# Altium schematic sheet DAC_MAX5841.SchDoc: MAX5841 DAC
size A4; Revision: 5; SheetNumber: 41; SheetTotal: 64; Organization: Altium Limited.; Address1: Level 3, 12a Rodborough Rd; Address2: Frenchs Forest 2086; Address3: NSW; Address4: AUSTRALIA
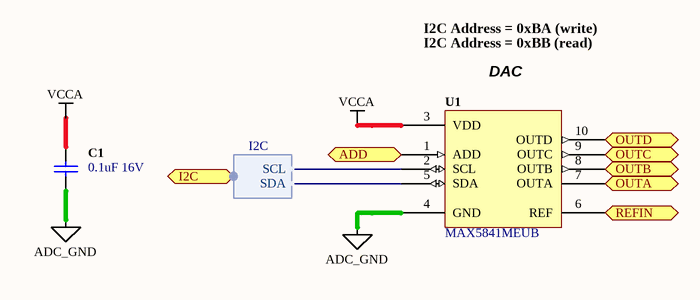
[diagram p0: DAC_MAX5841.SchDoc]

## Parts
C1  0.1uF 16V  [CAPC1005-STAR]
U1  MAX5841MEUB  [TSSOP50P490-10]

## Ports
ADD (bidir), I2C (harness I2C), OUTA (out), OUTB (out), OUTC (out), OUTD (out), REFIN (bidir)

## Harnesses
I2C: SCL, SDA

## Nets
ADC_GND: C1.2 U1.4(GND)
VCCA: C1.1 U1.3(VDD)
ADD: U1.1(ADD) ; port ADD
OUTA: U1.7(OUTA) ; port OUTA
OUTB: U1.8(OUTB) ; port OUTB
OUTC: U1.9(OUTC) ; port OUTC
OUTD: U1.10(OUTD) ; port OUTD
REFIN: U1.6(REF) ; port REFIN
NetU1_2: U1.2(SCL) ; port I2C.SCL
NetU1_5: U1.5(SDA) ; port I2C.SDA

## Notes on the sheet
- I2C Address = 0xBA (write)
- I2C Address = 0xBB (read)
- (near U1) DAC
- Sheet Title
- Project Title
- Size:
- Date:
- A4
- Assy:
- Time:
- Sheet
- Revision:
- of
- File:

## Library data of the parts
C1 = D-101-0080: Capacitor, Ceramic, 0.1uF 10% 16V 0402 (1005) X7R; Polarity: Non-Polarized; Category: Capacitor; Capacitance: 0.1 uF; Dielectric: X7R; Mounting Technology: Surface Mount; Rated Voltage: 16 V; Status: Production; Technology: Ceramic; Tolerance: 10 %
U1 = D-222-0001: MAX5841MEUB, Quad, 10-Bit, Low-Power, I2C, DAC; Category: IC-DAC; Status: Production